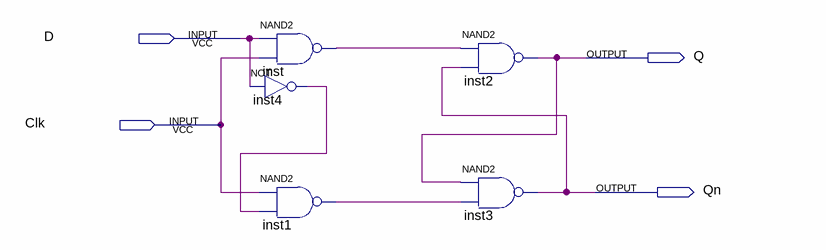
[diagram p0: schematic sheet]
// Quartus schematic realDlatch.bdf as structural Verilog: 5 symbols, 4 pins
module realDlatch (
  input  D,
  input  Clk,
  output Q,
  output Qn
);

  wire inst1_out, inst4_out, inst_out;

  nand inst (inst_out, D, Clk);
  not inst4 (inst4_out, D);
  nand inst1 (inst1_out, Clk, inst4_out);
  nand inst2 (Q, inst_out, Qn);
  nand inst3 (Qn, Q, inst1_out);
endmodule
